# Altium schematic sheet MP257_18x18.SchDoc: STM32MP257  I/Os
size A3; Date: Not used; ApprovedBy: Not used; CheckedBy: Not used; Author: Not used; CompanyName: STMicroelectronics; DrawnBy: Not used; Engineer: Not used; Organization: Not used; Address1: Not used; Address2: Not used; Address3: Not used; Address4: Not used; DocumentNumber: Not used; Revision: Not used; SheetNumber: 3; SheetTotal: 18; CurrentTime: Not used; CurrentDate: Not used; Time: Not used; DocumentFullPathAndName: Not used; DocumentName: Not used; ModifiedDate: Not used; ImagePath: Not used; ProjectName: Not used; Application_BuildNumber: Not used
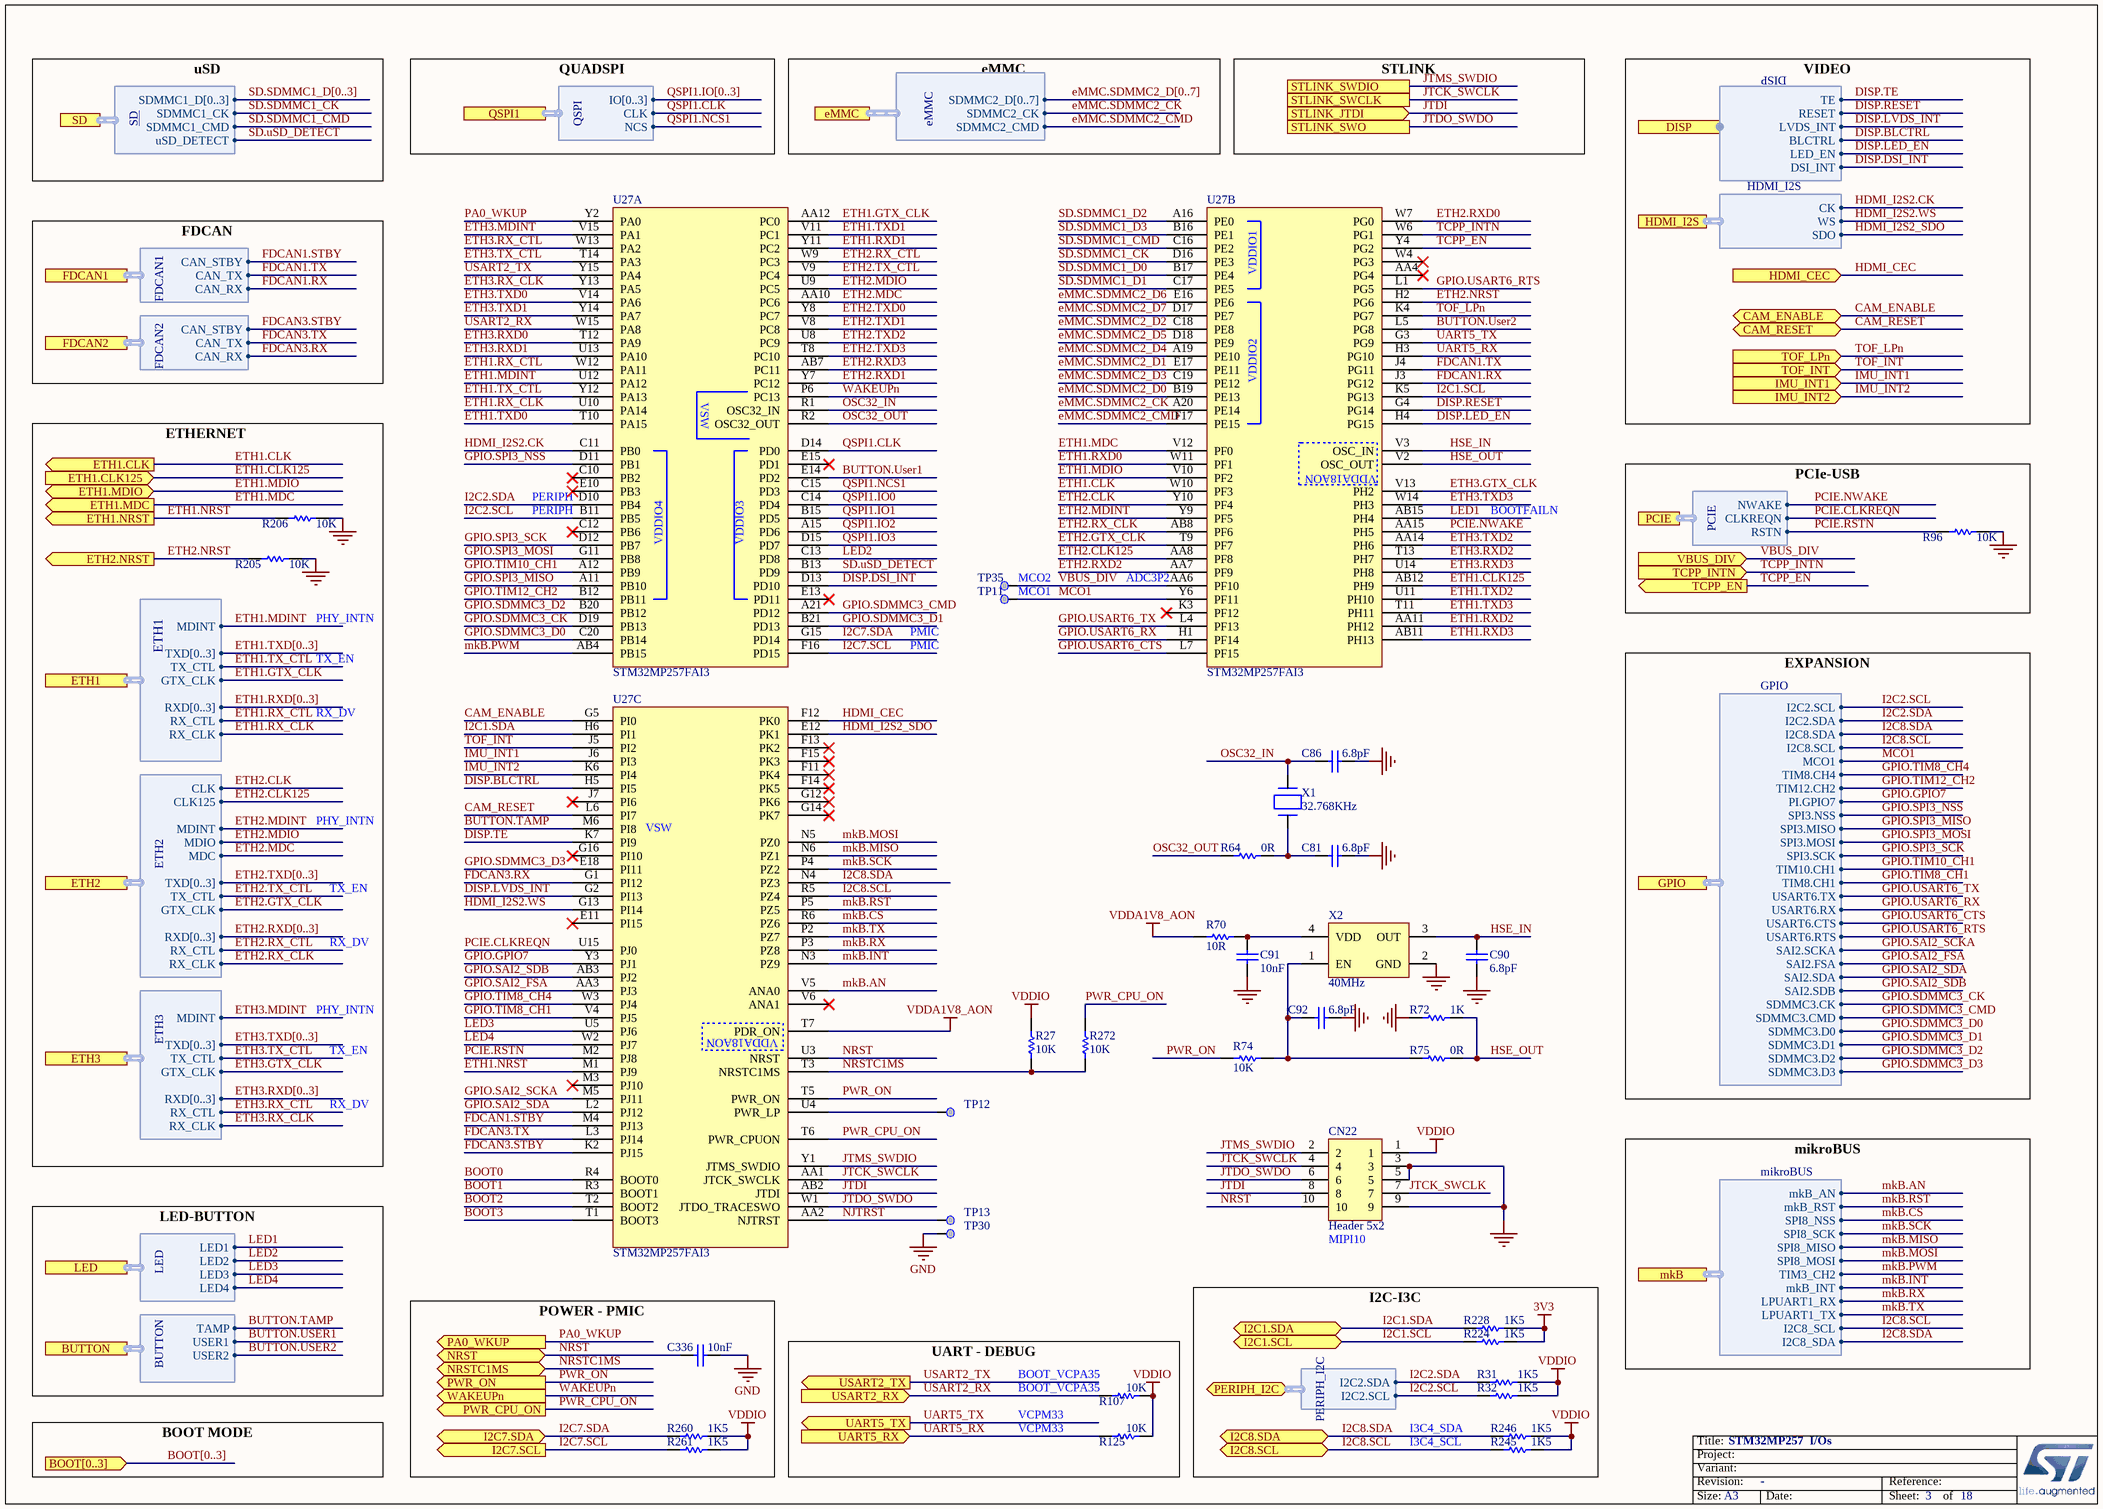
[diagram p0: MP257_18x18.SchDoc]

## Parts
C81  value 6.8pF  [C0402]  (hidden comment: Capacitor)
C86  value 6.8pF  [C0402]  (hidden comment: Capacitor)
C90  value 6.8pF  [C0402]  (hidden comment: Capacitor)
C91  value 10nF  [C0402]  (hidden comment: Capacitor)
C92  value 6.8pF  [C0402]  (hidden comment: Capacitor)
C336  value 10nF  [C0402]  (hidden comment: Capacitor)
CN22  Header 5x2  [CON_SAMTEC_FTSH-105-01-L-DV-K]
R27  value 10K  [R0402]  (hidden comment: Resistor)
R31  value 1K5  [R0402]  (hidden comment: Resistor)
R32  value 1K5  [R0402]  (hidden comment: Resistor)
R64  value 0R  [R0402]
R70  value 10R  [R0402]  (hidden comment: Resistor)
R72  value 1K  [R0402]
R74  value 10K  [R0402]  (hidden comment: Resistor)
R75  value 0R  [R0402]
R96  value 10K  [R0402]  (hidden comment: Resistor)
R107  value 10K  [R0402]  (hidden comment: Resistor)
R125  value 10K  [R0402]  (hidden comment: Resistor)
R205  value 10K  [R0402]  (hidden comment: Resistor)
R206  value 10K  [R0402]  (hidden comment: Resistor)
R224  value 1K5  [R0402]  (hidden comment: Resistor)
R228  value 1K5  [R0402]  (hidden comment: Resistor)
R245  value 1K5  [R0402]  (hidden comment: Resistor)
R246  value 1K5  [R0402]  (hidden comment: Resistor)
R260  value 1K5  [R0402]  (hidden comment: Resistor)
R261  value 1K5  [R0402]  (hidden comment: Resistor)
R272  value 10K  [R0402]  (hidden comment: Resistor)
TP11  Test Point  [TP_SMD_1MM]  (value not drawn)  (no BOM)
TP12  Test Point  [TP_SMD_1MM]  (value not drawn)  (no BOM)
TP13  Test Point  [TP_SMD_1MM]  (value not drawn)  (no BOM)
TP30  Test Point  [TP_SMD_1MM]  (value not drawn)  (no BOM)
TP35  Test Point  [TP_SMD_1MM]  (value not drawn)  (no BOM)
U27  STM32MP257FAI3  [ICC_LFBGA436_18X18_P080_H1P70_STM32MP257_CODE-B0D1]  (parts A,B,C of 9)
X1  value 32.768KHz  [CRY_NX2012SA_2P]  (hidden comment: XTAL_2_PINS)
X2  value 40MHz  [CRY_NZ1612SH_4P]  (hidden comment: OSCILLATOR_4_PINS)

## Ports
BOOT[0..3] (in), BUTTON (harness BUTTON), CAM_ENABLE (bidir), CAM_RESET (bidir), DISP (harness DISP), eMMC (harness eMMC), ETH1 (harness ETH1), ETH1.CLK125 (in), ETH1.CLK (out), ETH1.MDC (out), ETH1.MDIO (bidir), ETH1.NRST (out), ETH2 (harness ETH2), ETH2.NRST (out), ETH3 (harness ETH3), FDCAN1 (harness FDCAN1), FDCAN2 (harness FDCAN2), GPIO (harness GPIO), HDMI_CEC (in), HDMI_I2S (harness HDMI_I2S), I2C1.SCL (bidir), I2C1.SDA (bidir), I2C7.SCL (out), I2C7.SDA (bidir), I2C8.SCL (bidir), I2C8.SDA (bidir), IMU_INT1 (in), IMU_INT2 (in), LED (harness LED), mkB (harness mikroBUS), NRST (bidir), NRSTC1MS (bidir), PA0_WKUP (out), PCIE (harness PCIE), PERIPH_I2C (bidir, harness PERIPH_I2C), PWR_CPU_ON (out), PWR_ON (out), QSPI1 (harness QSPI), SD (harness SD), STLINK_JTDI (in), STLINK_SWCLK, STLINK_SWDIO, STLINK_SWO, TCPP_EN (out), TCPP_INTN (in), TOF_INT (in), TOF_LPn (in), UART5_RX (in), UART5_TX (out), USART2_RX (in), USART2_TX (out), VBUS_DIV (in), WAKEUPn (out)

## Harnesses
ETH2: MDINT, CLK125, TXD[0..3], MDIO, MDC, RX_CLK, GTX_CLK, TX_CTL, RXD[0..3], RX_CTL, CLK
ETH3: MDINT, TXD[0..3], RX_CLK, GTX_CLK, TX_CTL, RXD[0..3], RX_CTL
ETH1: MDINT, TXD[0..3], RX_CLK, GTX_CLK, TX_CTL, RXD[0..3], RX_CTL
HDMI_I2S: CK, SDO, WS
QSPI: IO[0..3], CLK, NCS
GPIO: I2C2.SCL, I2C2.SDA, I2C8.SDA, MCO1, TIM8.CH4, TIM12.CH2, PI.GPIO7, SPI3.NSS, SPI3.MISO, SPI3.MOSI, SPI3.SCK, TIM10.CH1, TIM8.CH1, USART6.TX, USART6.RX, USART6.CTS, USART6.RTS, SDMMC3.CK, SDMMC3.CMD, SDMMC3.D0, SDMMC3.D1, SDMMC3.D2, SDMMC3.D3, I2C8.SCL, SAI2.SCKA, SAI2.FSA, SAI2.SDA, SAI2.SDB
PERIPH_I2C: I2C2.SDA, I2C2.SCL
PCIE: NWAKE, CLKREQN, RSTN
SD: SDMMC1_D[0..3], SDMMC1_CK, SDMMC1_CMD, uSD_DETECT
FDCAN1: CAN_STBY, CAN_TX, CAN_RX
FDCAN2: CAN_STBY, CAN_TX, CAN_RX
LED: LED1, LED2, LED3, LED4
BUTTON: TAMP, USER1, USER2
eMMC: SDMMC2_CK, SDMMC2_CMD, SDMMC2_D[0..7]
mikroBUS: I2C8_SDA, SPI8_NSS, SPI8_MISO, SPI8_MOSI, SPI8_SCK, TIM3_CH2, LPUART1_RX, I2C8_SCL, LPUART1_TX, mkB_INT, mkB_RST, mkB_AN
DISP: RESET, TE, LVDS_INT, BLCTRL, LED_EN, DSI_INT

## Nets
3V3: R224.2 R228.2
GND: C81.2 C86.2 C90.1 C91.1 C92.2 C336.1 CN22.3 CN22.5 CN22.9 R72.2 R96.2 R205.2 R206.2 TP30.1 X2.2(GND)
VDDA1V8_AON: R70.1 U27.T7(PDR_ON)
VDDIO: CN22.1 R27.2 R31.2 R32.2 R107.2 R125.2 R245.2 R246.2 R260.2 R261.2
BOOT0: U27.R4(BOOT0)
BOOT1: U27.R3(BOOT1)
BOOT2: U27.T2(BOOT2)
BOOT3: U27.T1(BOOT3)
BUTTON.TAMP: U27.M6(PI8) ; port BUTTON.TAMP
BUTTON.User1: U27.E14(PD2) ; port BUTTON.USER1
BUTTON.User2: U27.L5(PG8) ; port BUTTON.USER2
CAM_ENABLE: U27.G5(PI0) ; port CAM_ENABLE
CAM_RESET: U27.L6(PI7) ; port CAM_RESET
DISP.BLCTRL: U27.H5(PI5) ; port DISP.BLCTRL
DISP.DSI_INT: U27.D13(PD10) ; port DISP.DSI_INT
DISP.LED_EN: U27.H4(PG15) ; port DISP.LED_EN
DISP.LVDS_INT: U27.G2(PI13) ; port DISP.LVDS_INT
DISP.RESET: U27.G4(PG14) ; port DISP.RESET
DISP.TE: U27.K7(PI9) ; port DISP.TE
eMMC.SDMMC2_CK: U27.A20(PE14) ; port eMMC.SDMMC2_CK
eMMC.SDMMC2_CMD: U27.F17(PE15) ; port eMMC.SDMMC2_CMD
eMMC.SDMMC2_D0: U27.B19(PE13)
eMMC.SDMMC2_D1: U27.E17(PE11)
eMMC.SDMMC2_D2: U27.C18(PE8)
eMMC.SDMMC2_D3: U27.C19(PE12)
eMMC.SDMMC2_D4: U27.A19(PE10)
eMMC.SDMMC2_D5: U27.D18(PE9)
eMMC.SDMMC2_D6: U27.E16(PE6)
eMMC.SDMMC2_D7: U27.D17(PE7)
ETH1.CLK: U27.W10(PF3) ; port ETH1.CLK
ETH1.CLK125: U27.AB12(PH9) ; port ETH1.CLK125
ETH1.GTX_CLK: U27.AA12(PC0) ; port ETH1.GTX_CLK
ETH1.MDC: U27.V12(PF0) ; port ETH1.MDC
ETH1.MDINT: U27.U12(PA12) ; port ETH1.MDINT
ETH1.MDIO: U27.V10(PF2) ; port ETH1.MDIO
ETH1.NRST: R206.1 U27.M1(PJ9) ; port ETH1.NRST
ETH1.RX_CLK: U27.U10(PA14) ; port ETH1.RX_CLK
ETH1.RX_CTL: U27.W12(PA11) ; port ETH1.RX_CTL
ETH1.RXD0: U27.W11(PF1)
ETH1.RXD1: U27.Y11(PC2)
ETH1.RXD2: U27.AA11(PH12)
ETH1.RXD3: U27.AB11(PH13)
ETH1.TX_CTL: U27.Y12(PA13) ; port ETH1.TX_CTL
ETH1.TXD0: U27.T10(PA15)
ETH1.TXD1: U27.V11(PC1)
ETH1.TXD2: U27.U11(PH10)
ETH1.TXD3: U27.T11(PH11)
ETH2.CLK: U27.Y10(PF4) ; port ETH2.CLK
ETH2.CLK125: U27.AA8(PF8) ; port ETH2.CLK125
ETH2.GTX_CLK: U27.T9(PF7) ; port ETH2.GTX_CLK
ETH2.MDC: U27.AA10(PC6) ; port ETH2.MDC
ETH2.MDINT: U27.Y9(PF5) ; port ETH2.MDINT
ETH2.MDIO: U27.U9(PC5) ; port ETH2.MDIO
ETH2.NRST: R205.1 U27.H2(PG6) ; port ETH2.NRST
ETH2.RX_CLK: U27.AB8(PF6) ; port ETH2.RX_CLK
ETH2.RX_CTL: U27.W9(PC3) ; port ETH2.RX_CTL
ETH2.RXD0: U27.W7(PG0)
ETH2.RXD1: U27.Y7(PC12)
ETH2.RXD2: U27.AA7(PF9)
ETH2.RXD3: U27.AB7(PC11)
ETH2.TX_CTL: U27.V9(PC4) ; port ETH2.TX_CTL
ETH2.TXD0: U27.Y8(PC7)
ETH2.TXD1: U27.V8(PC8)
ETH2.TXD2: U27.U8(PC9)
ETH2.TXD3: U27.T8(PC10)
ETH3.GTX_CLK: U27.V13(PH2) ; port ETH3.GTX_CLK
ETH3.MDINT: U27.V15(PA1) ; port ETH3.MDINT
ETH3.RX_CLK: U27.Y13(PA5) ; port ETH3.RX_CLK
ETH3.RX_CTL: U27.W13(PA2) ; port ETH3.RX_CTL
ETH3.RXD0: U27.T12(PA9)
ETH3.RXD1: U27.U13(PA10)
ETH3.RXD2: U27.T13(PH7)
ETH3.RXD3: U27.U14(PH8)
ETH3.TX_CTL: U27.T14(PA3) ; port ETH3.TX_CTL
ETH3.TXD0: U27.V14(PA6)
ETH3.TXD1: U27.Y14(PA7)
ETH3.TXD2: U27.AA14(PH6)
ETH3.TXD3: U27.W14(PH3)
FDCAN1.RX: U27.J3(PG12) ; port FDCAN1.CAN_RX
FDCAN1.STBY: U27.M4(PJ13) ; port FDCAN1.CAN_STBY
FDCAN1.TX: U27.J4(PG11) ; port FDCAN1.CAN_TX
FDCAN3.RX: U27.G1(PI12) ; port FDCAN2.CAN_RX
FDCAN3.STBY: U27.K2(PJ15) ; port FDCAN2.CAN_STBY
FDCAN3.TX: U27.L3(PJ14) ; port FDCAN2.CAN_TX
GPIO.GPIO7: U27.Y3(PJ1) ; port GPIO.PI.GPIO7
GPIO.SAI2_FSA: U27.AA3(PJ3) ; port GPIO.SAI2.FSA
GPIO.SAI2_SCKA: U27.M5(PJ11) ; port GPIO.SAI2.SCKA
GPIO.SAI2_SDA: U27.L2(PJ12) ; port GPIO.SAI2.SDA
GPIO.SAI2_SDB: U27.AB3(PJ2) ; port GPIO.SAI2.SDB
GPIO.SDMMC3_CK: U27.D19(PB13) ; port GPIO.SDMMC3.CK
GPIO.SDMMC3_CMD: U27.A21(PD12) ; port GPIO.SDMMC3.CMD
GPIO.SDMMC3_D0: U27.C20(PB14) ; port GPIO.SDMMC3.D0
GPIO.SDMMC3_D1: U27.B21(PD13) ; port GPIO.SDMMC3.D1
GPIO.SDMMC3_D2: U27.B20(PB12) ; port GPIO.SDMMC3.D2
GPIO.SDMMC3_D3: U27.E18(PI11) ; port GPIO.SDMMC3.D3
GPIO.SPI3_MISO: U27.A11(PB10) ; port GPIO.SPI3.MISO
GPIO.SPI3_MOSI: U27.G11(PB8) ; port GPIO.SPI3.MOSI
GPIO.SPI3_NSS: U27.D11(PB1) ; port GPIO.SPI3.NSS
GPIO.SPI3_SCK: U27.D12(PB7) ; port GPIO.SPI3.SCK
GPIO.TIM8_CH1: U27.V4(PJ5) ; port GPIO.TIM8.CH1
GPIO.TIM8_CH4: U27.W3(PJ4) ; port GPIO.TIM8.CH4
GPIO.TIM10_CH1: U27.A12(PB9) ; port GPIO.TIM10.CH1
GPIO.TIM12_CH2: U27.B12(PB11) ; port GPIO.TIM12.CH2
GPIO.USART6_CTS: U27.L7(PF15) ; port GPIO.USART6.CTS
GPIO.USART6_RTS: U27.L1(PG5) ; port GPIO.USART6.RTS
GPIO.USART6_RX: U27.H1(PF14) ; port GPIO.USART6.RX
GPIO.USART6_TX: U27.L4(PF13) ; port GPIO.USART6.TX
HDMI_CEC: U27.F12(PK0) ; port HDMI_CEC
HDMI_I2S2.CK: U27.C11(PB0) ; port HDMI_I2S.CK
HDMI_I2S2.WS: U27.G13(PI14) ; port HDMI_I2S.WS
HDMI_I2S2_SDO: U27.E12(PK1) ; port HDMI_I2S.SDO
HSE_IN: C90.2 U27.V3(OSC_IN) X2.3(OUT)
HSE_OUT: R72.1 R75.2 U27.V2(OSC_OUT)
I2C1.SCL: R224.1 U27.K5(PG13) ; port I2C1.SCL
I2C1.SDA: R228.1 U27.H6(PI1) ; port I2C1.SDA
I2C2.SCL: R32.1 U27.B11(PB5) ; port GPIO.I2C2.SCL, port PERIPH_I2C.I2C2.SCL
I2C2.SDA: R31.1 U27.D10(PB4) ; port GPIO.I2C2.SDA, port PERIPH_I2C.I2C2.SDA
I2C7.SCL: R261.1 U27.F16(PD15) ; port I2C7.SCL
I2C7.SDA: R260.1 U27.G15(PD14) ; port I2C7.SDA
I2C8.SCL: R245.1 U27.R5(PZ4) ; port I2C8.SCL, port GPIO.I2C8.SCL, port mkB.I2C8_SCL
I2C8.SDA: R246.1 U27.N4(PZ3) ; port I2C8.SDA, port GPIO.I2C8.SDA, port mkB.I2C8_SDA
IMU_INT1: U27.J6(PI3) ; port IMU_INT1
IMU_INT2: U27.K6(PI4) ; port IMU_INT2
JTCK_SWCLK: CN22.4 CN22.7 U27.AA1(JTCK_SWCLK) ; port STLINK_SWCLK
JTDI: CN22.8 U27.AB2(JTDI) ; port STLINK_JTDI
JTDO_SWDO: CN22.6 U27.W1(JTDO_TRACESWO) ; port STLINK_SWO
JTMS_SWDIO: CN22.2 U27.Y1(JTMS_SWDIO) ; port STLINK_SWDIO
LED1: U27.AB15(PH4) ; port LED.LED1
LED2: U27.C13(PD8) ; port LED.LED2
LED3: U27.U5(PJ6) ; port LED.LED3
LED4: U27.W2(PJ7) ; port LED.LED4
MCO1: TP11.1 U27.Y6(PF11) ; port GPIO.MCO1
mkB.AN: U27.V5(ANA0) ; port mkB.mkB_AN
mkB.CS: U27.R6(PZ6) ; port mkB.SPI8_NSS
mkB.INT: U27.N3(PZ9) ; port mkB.mkB_INT
mkB.MISO: U27.N6(PZ1) ; port mkB.SPI8_MISO
mkB.MOSI: U27.N5(PZ0) ; port mkB.SPI8_MOSI
mkB.PWM: U27.AB4(PB15) ; port mkB.TIM3_CH2
mkB.RST: U27.P5(PZ5) ; port mkB.mkB_RST
mkB.RX: U27.P3(PZ8) ; port mkB.LPUART1_RX
mkB.SCK: U27.P4(PZ2) ; port mkB.SPI8_SCK
mkB.TX: U27.P2(PZ7) ; port mkB.LPUART1_TX
NJTRST: TP13.1 U27.AA2(NJTRST)
NRST: C336.2 CN22.10 U27.U3(NRST) ; port NRST
NRSTC1MS: R27.1 R272.1 U27.T3(NRSTC1MS) ; port NRSTC1MS
OSC32_IN: C86.1 U27.R1(OSC32_IN) X1.2(X2)
OSC32_OUT: R64.1 U27.R2(OSC32_OUT)
PA0_WKUP: U27.Y2(PA0) ; port PA0_WKUP
PCIE.CLKREQN: U27.U15(PJ0) ; port PCIE.CLKREQN
PCIE.NWAKE: U27.AA15(PH5) ; port PCIE.NWAKE
PCIE.RSTN: R96.1 U27.M2(PJ8) ; port PCIE.RSTN
PWR_CPU_ON: R272.2 U27.T6(PWR_CPUON) ; port PWR_CPU_ON
PWR_ON: R74.2 U27.T5(PWR_ON) ; port PWR_ON
QSPI1.CLK: U27.D14(PD0) ; port QSPI1.CLK
QSPI1.IO0: U27.C14(PD4)
QSPI1.IO1: U27.B15(PD5)
QSPI1.IO2: U27.A15(PD6)
QSPI1.IO3: U27.D15(PD7)
QSPI1.NCS1: U27.C15(PD3) ; port QSPI1.NCS
SD.SDMMC1_CK: U27.D16(PE3) ; port SD.SDMMC1_CK
SD.SDMMC1_CMD: U27.C16(PE2) ; port SD.SDMMC1_CMD
SD.SDMMC1_D0: U27.B17(PE4)
SD.SDMMC1_D1: U27.C17(PE5)
SD.SDMMC1_D2: U27.A16(PE0)
SD.SDMMC1_D3: U27.B16(PE1)
SD.uSD_DETECT: U27.B13(PD9) ; port SD.uSD_DETECT
TCPP_EN: U27.Y4(PG2) ; port TCPP_EN
TCPP_INTN: U27.W6(PG1) ; port TCPP_INTN
TOF_INT: U27.J5(PI2) ; port TOF_INT
TOF_LPn: U27.K4(PG7) ; port TOF_LPn
UART5_RX: R125.1 U27.H3(PG10) ; port UART5_RX
UART5_TX: U27.G3(PG9) ; port UART5_TX
USART2_RX: R107.1 U27.W15(PA8) ; port USART2_RX
USART2_TX: U27.Y15(PA4) ; port USART2_TX
VBUS_DIV: TP35.1 U27.AA6(PF10) ; port VBUS_DIV
WAKEUPn: U27.P6(PC13) ; port WAKEUPn
NetC81_1: C81.1 R64.2 X1.1(X1)
NetC91_2: C91.2 R70.2 X2.4(VDD)
NetC92_1: C92.1 R74.1 R75.1 X2.1(EN)
NetTP12_1: TP12.1 U27.U4(PWR_LP)

Not connected (* = marked no-connect by the designer): U27 AA4(PG4)* C10(PB2)* C12(PB6)* E10(PB3)* E11(PI15)* E13(PD11)* E15(PD1)* F11(PK4)* F13(PK2)* F14(PK5)* F15(PK3)* G12(PK6)* G14(PK7)* G16(PI10)* J7(PI6)* K3(PF12)* M3(PJ10)* V6(ANA1)* W4(PG3)*

## Buses and harness runs
bus BOOT[0..3] = port BOOT[0..3]
bus eMMC.SDMMC2_D[0..7]
bus ETH1.RXD[0..3]
bus ETH1.TXD[0..3]
bus ETH2.RXD[0..3]
bus ETH2.TXD[0..3]
bus ETH3.RXD[0..3]
bus ETH3.TXD[0..3]
bus QSPI1.IO[0..3]
bus SD.SDMMC1_D[0..3]

## Notes on the sheet
- uSD
- QUADSPI
- eMMC
- STLINK
- FDCAN
- VIDEO
- (near U27) PERIPH
- BOOTFAILN
- MCO2
- (near U27) ADC3P2
- PHY_INTN
- PMIC
- MCO1
- (near R96) PCIe-USB
- RX_DV
- TX_EN
- EXPANSION
- ETHERNET
- (near CN22) MIPI10
- LED-BUTTON
- (near R107) BOOT_VCPA35
- mikroBUS
- VCPM33
- I3C4_SDA
- I3C4_SCL
- BOOT MODE
- POWER - PMIC
- UART - DEBUG
- I2C-I3C
- Title:
- Project:
- Size:
- Revision:
- Variant:
- A3
- -
- Date:
- Reference:
- Sheet:
- of
- (in symbol MCD-02000, part A) VSW
- (in symbol MCD-02000, part C) VSW

## Library data of the parts
C81 C86 = MCD-00674: Capacitor, MLCC, 6.8pF, 50V, NPO, +-0.25pF, 0402, T=0.5mm; Manufacturer_Part_Number: CC0402CRNPO9BN6R8; Manufacturer: YAGEO; Part_Preference: Recommended; Provided_By: SUBCO; Initial_Board_Reference: MB1319; Path: ws/MCD_ApplicationBoards/Lists/MCDPARTSdatabase; Item Type: Item; Component_Country_Of_Origin: China; ID: 3068; ShowFields: YES; Internal_Part_Number: MCD-00674; Status: Released; Part_Type: Capacitor; Package: 0402; ComponentLink1Description: Datasheet; ComponentLink1URL: http://tunmcdsvn.tun.st.com/Component_Documentation_Library/Trunk/Capacitor/YAGEO_NP0_Series; Alternate_Manufacturer: N/A; Alternate_Manufacturer_Part_Number: N/A; Order_Code_Digikey: 311-3327-1-ND; Order_Code_Farnell: N/A; Order_Code_RS: N/A
C90 C92 = MCD-00674: Capacitor, MLCC, 6.8pF, 50V, NPO, +-0.25pF, 0402, T=0.5mm; Manufacturer_Part_Number: CC0402CRNPO9BN6R8; Manufacturer: YAGEO; Part_Preference: Recommended; Provided_By: SUBCO; Initial_Board_Reference: MB1319; Component_Country_Of_Origin: China; ID: 3068; ShowFields: YES; Internal_Part_Number: MCD-00674; Status: Released; Part_Type: Capacitor; Package: 0402; ComponentLink1Description: Datasheet; ComponentLink1URL: http://tunmcdsvn.tun.st.com/Component_Documentation_Library/Trunk/Capacitor/YAGEO_NP0_Series; ECCN_US: n/a; ECCN_EU: n/a; Alternate_Manufacturer: N/A; Alternate_Manufacturer_Part_Number: N/A; Order_Code_Digikey: 311-3327-1-ND; Order_Code_Farnell: N/A; Order_Code_RS: N/A
C91 = MCD-00011: Capacitor, MLCC, 10nF, 16V, X7R, 10%, 0402, T=0.5mm; Manufacturer_Part_Number: CC0402KRX7R7BB103; Manufacturer: YAGEO; Part_Preference: Recommended; Provided_By: SUBCO; Initial_Board_Reference: MB1274; Order_Code_RS: 669-8688; Component_Country_Of_Origin: China; ID: 2469; ShowFields: YES; Internal_Part_Number: MCD-00011; Status: Released; Part_Type: Capacitor; Package: 0402; ComponentLink1Description: Datasheet; ComponentLink1URL: http://tunmcdsvn.tun.st.com/Component_Documentation_Library/Trunk/Capacitor/YAGEO_X7R_Series; ECCN_US: n/a; ECCN_EU: n/a; Alternate_Manufacturer: N/A; Alternate_Manufacturer_Part_Number: N/A; Order_Code_Digikey: 311-1042-1-ND; Order_Code_Farnell: 3019275
C336 = MCD-00011: Capacitor, MLCC, 10nF, 16V, X7R, 10%, 0402, T=0.5mm; Manufacturer_Part_Number: CC0402KRX7R7BB103; Manufacturer: YAGEO; Provided_By: SUBCO; Initial_Board_Reference: MB1274; Internal_Part_Number: MCD-00011; Status: Released; Part_Type: Capacitor; Package: C0402; ComponentLink1Description: Datasheet; ComponentLink1URL: http://tunmcdsvn.tun.st.com/Component_Datasheet_Library/Trunk/Capacitors/Yageo_Multilayer_Capacitor_X7R_series_100pF_to_22uF; ECCN_US: n/a; ECCN_EU: n/a
CN22 = MCD-01951: Header, 5x2, 1.27mm, VR, SMD, T=5.97mm; Part_Type: Connector; Part_Preference: Recommended; Manufacturer: SAMTEC; Manufacturer_Part_Number: FTSH-105-01-L-DV-K-A; Order_Code_RS: 159-2343; Component_Country_Of_Origin: China, Costa Rica, Malaysia, United States, Vietnam; ShowFields: YES; ID: 4051; Internal_Part_Number: MCD-01951; Value: Header 5x2; Status: Released; Package: SMT; ComponentLink1URL: http://tunmcdsvn.tun.st.com/Component_Documentation_Library/Trunk/Connector/SAMTEC_FTSH_Series/; Order_Code_Digikey: SAM9439-ND; Order_Code_Farnell: 2856879
R27 R74 R107 R125 R272 = MCD-00053: Resistor,10K,0402,1%,1/16W; BMS_Part_Number: 9131590; Part_Preference: Recommended; Manufacturer: YAGEO; Manufacturer_Part_Number: RC0402FR-0710KL; Component_Country_Of_Origin: China; ID: 2539; ShowFields: YES; Internal_Part_Number: MCD-00053; Status: Released; Part_Type: Resistor; Package: 0402; ComponentLink1Description: Datasheet; ComponentLink1URL: http://tunmcdsvn.tun.st.com/Component_Documentation_Library/Trunk/Resistor/YAGEO_RC_L_Series; Order_Code_Digikey: 311-10.0KLRCT-ND; Order_Code_Farnell: 9239359; Order_Code_RS: N/A; Alternate_Manufacturer: N/A; Alternate_Manufacturer_Part_Number: N/A
R31 R32 R224 R228 R245 R246 R260 R261 = MCD-00068: Resistor,1K5,0402,1%,1/16W; Part_Preference: Recommended; Manufacturer: YAGEO; Manufacturer_Part_Number: RC0402FR-071K5L; Component_Country_Of_Origin: China; ID: 2524; ShowFields: YES; Internal_Part_Number: MCD-00068; Status: Released; Part_Type: Resistor; Package: 0402; ComponentLink1Description: Datasheet; ComponentLink1URL: http://tunmcdsvn.tun.st.com/Component_Documentation_Library/Trunk/Resistor/YAGEO_RC_L_Series; Order_Code_Digikey: 311-1.50KLRCT-ND; Order_Code_Farnell: 9239251; Order_Code_RS: N/A
  R31 R32 R224 R228 R245 R246: Alternate_Manufacturer: N/A; Alternate_Manufacturer_Part_Number: N/A
R64 R75 = MCD-00052: Resistor,0R,0402,5%,1/16W; Manufacturer_Part_Number: RC0402JR-070RL; Manufacturer: YAGEO; Part_Preference: Recommended; Provided_By: SUBCO; Initial_Board_Reference: mb1274; Order_Code_RS: 618-5804; Component_Country_Of_Origin: China; ID: 2540; ShowFields: YES; Internal_Part_Number: MCD-00052; ComponentLink1Description: Datasheet; ECCN_US: n/a; ECCN_EU: n/a; Status: Released; Part_Type: Resistor; ComponentLink1URL: http://tunmcdsvn.tun.st.com/Component_Documentation_Library/Trunk/Resistor/YAGEO_RC_L_Series; Package: 0402; Alternate_Manufacturer: N/A; Alternate_Manufacturer_Part_Number: N/A; Order_Code_Digikey: 311-0.0JRCT-ND; Order_Code_Farnell: 9232516RL
R70 = MCD-00358: Resistor,10R,0402,1%,1/16W; Manufacturer_Part_Number: RC0402FR-0710RL; Manufacturer: YAGEO; Part_Preference: Recommended; Provided_By: SUBCO; Order_Code_RS: 618-5848; Component_Country_Of_Origin: China; ID: 2919; ShowFields: YES; Internal_Part_Number: MCD-00358; Status: Released; Part_Type: Resistor; Package: 0402; ComponentLink1Description: Datasheet; ComponentLink1URL: http://tunmcdsvn.tun.st.com/Component_Documentation_Library/Trunk/Resistor/YAGEO_RC_L_Series; Alternate_Manufacturer: N/A; Alternate_Manufacturer_Part_Number: N/A; Order_Code_Digikey: 311-10.0LRCT-ND; Order_Code_Farnell: 9238999
R72 = MCD-00061: Resistor,1K,0402,1%,1/16W; Manufacturer_Part_Number: RC0402FR-071KL; Manufacturer: YAGEO; Part_Preference: Recommended; Provided_By: SUBCO; Initial_Board_Reference: mb1274; Component_Country_Of_Origin: China; ID: 2532; ShowFields: YES; Internal_Part_Number: MCD-00061; ComponentLink1Description: Datasheet; ECCN_US: n/a; ECCN_EU: n/a; Status: Released; Part_Type: Resistor; ComponentLink1URL: http://tunmcdsvn.tun.st.com/Component_Documentation_Library/Trunk/Resistor/YAGEO_RC_L_Series; Package: 0402; Alternate_Manufacturer: N/A; Alternate_Manufacturer_Part_Number: N/A; Order_Code_Digikey: 311-1.00KLRCT-ND; Order_Code_Farnell: 9239235; Order_Code_RS: N/A
R96 R205 R206 = MCD-00053: Resistor,10K,0402,1%,1/16W; Manufacturer_Part_Number: RC0402FR-0710KL; Manufacturer: YAGEO; BMS_Part_Number: 9131590; Part_Preference: Recommended; Component_Country_Of_Origin: China; ID: 2539; ShowFields: YES; Internal_Part_Number: MCD-00053; ComponentLink1Description: Datasheet; Status: Released; Part_Type: Resistor; ComponentLink1URL: http://tunmcdsvn.tun.st.com/Component_Documentation_Library/Trunk/Resistor/YAGEO_RC_L_Series; Package: 0402; Order_Code_Digikey: 311-10.0KLRCT-ND; Order_Code_Farnell: 9239359; Order_Code_RS: N/A; Alternate_Manufacturer: N/A; Alternate_Manufacturer_Part_Number: N/A
TP11-TP13 TP30 TP35 = MCD-00074: Test Point 1mm; Part_Type: Misc; Part_Preference: Recommended; Initial_Board_Reference: MB1274; ID: 2518; ShowFields: YES; Internal_Part_Number: MCD-00074; Status: Released; Manufacturer_Part_Number: n/a; Manufacturer: n/a; ComponentLink1Description: Datasheet; ComponentLink1URL: http://na; ECCN_US: n/a; ECCN_EU: n/a; Provided_By: n/a; Order_Code_Digikey: N/A; Order_Code_Farnell: N/A; Order_Code_RS: N/A
U27 = MCD-02000: MPU, ARM Cortex-A35 + M33 32-bit MPU, 808KB RAM, With Crypto; Part_Type: IC; Part_Preference: Recommended; Manufacturer: STMICROELECTRONICS; Manufacturer_HQ_COO: EU; Component_Country_Of_Origin: Unknown; ShowFields: YES; ID: 4100; Internal_Part_Number: MCD-02000; Value: STM32MP257FAI3; Status: Checked; Manufacturer_Part_Number: STM32MP257FAI3; Package: LFBGA-436; ComponentLink1URL: http://tunmcdsvn.tun.st.com/Component_Documentation_Library/Trunk/IC/STMICROELECTRONICS_STM32MP257FAI3; Order_Code_Digikey: N/A; Order_Code_Farnell: N/A; Order_Code_RS: N/A
X1 = MCD-01479: Crystal, 32.768kHz, 6pF, +/-20ppm, 80K, 2.05x1.2mm; BMS_Part_Number: 9157049; Part_Type: Crystal_Osc; Part_Preference: Recommended; Manufacturer: NDK; Manufacturer_Part_Number: NX2012SA-32.768KHZ-EXS00A-MU00527; Component_Country_Of_Origin: Unknown; ShowFields: YES; ID: 3579; Internal_Part_Number: MCD-01479; Status: Released; Package: 2.05x1.2mm; ComponentLink1URL: http://tunmcdsvn.tun.st.com/Component_Documentation_Library/Trunk/Crytal_Oscillator/NDK_NX2012SA_Series; Order_Code_Digikey: 644-1352; Order_Code_Farnell: N/A; Order_Code_RS: N/A
X2 = MCD-02343: Oscillator, SPXO, 40Mhz, +/-50ppm, 1.8V, square wave, 1.6x1.2mm; Part_Type: Crystal_Osc; Part_Preference: Recommended; Manufacturer: NDK; Manufacturer_Part_Number: NZ1612SH 40MHZ END5951A; Component_Country_Of_Origin: Unknown; ID: 4449; ShowFields: YES; Internal_Part_Number: MCD-02343; Status: Checked; Alternate_Manufacturer: N/A; Alternate_Manufacturer_Part_Number: N/A; Package: 1.6x1.2mm; ComponentLink1URL: http://tunmcdsvn.tun.st.com/Component_Documentation_Library/Trunk/Crytal_Oscillator/NDK_NZ1612SH_Series/; Order_Code_Digikey: N/A; Order_Code_Farnell: N/A; Order_Code_RS: N/A